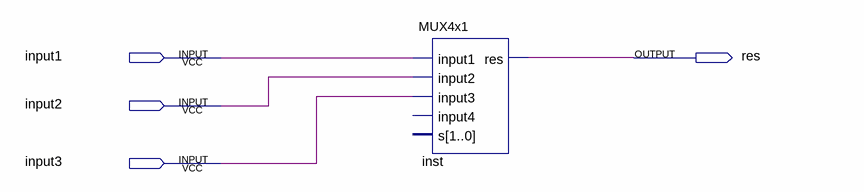
[diagram p0: schematic sheet]
// Quartus schematic block_mux4x1.bdf as structural Verilog: 1 symbols, 4 pins
module block_mux4x1 (
  input  input1,
  input  input2,
  input  input3,
  output res
);

  MUX4x1 inst (.input1(input1), .input2(input2), .input3(input3), .res(res));  // open: input4, s
endmodule
